# EAGLE design reflow (EAGLE 7.6.0)
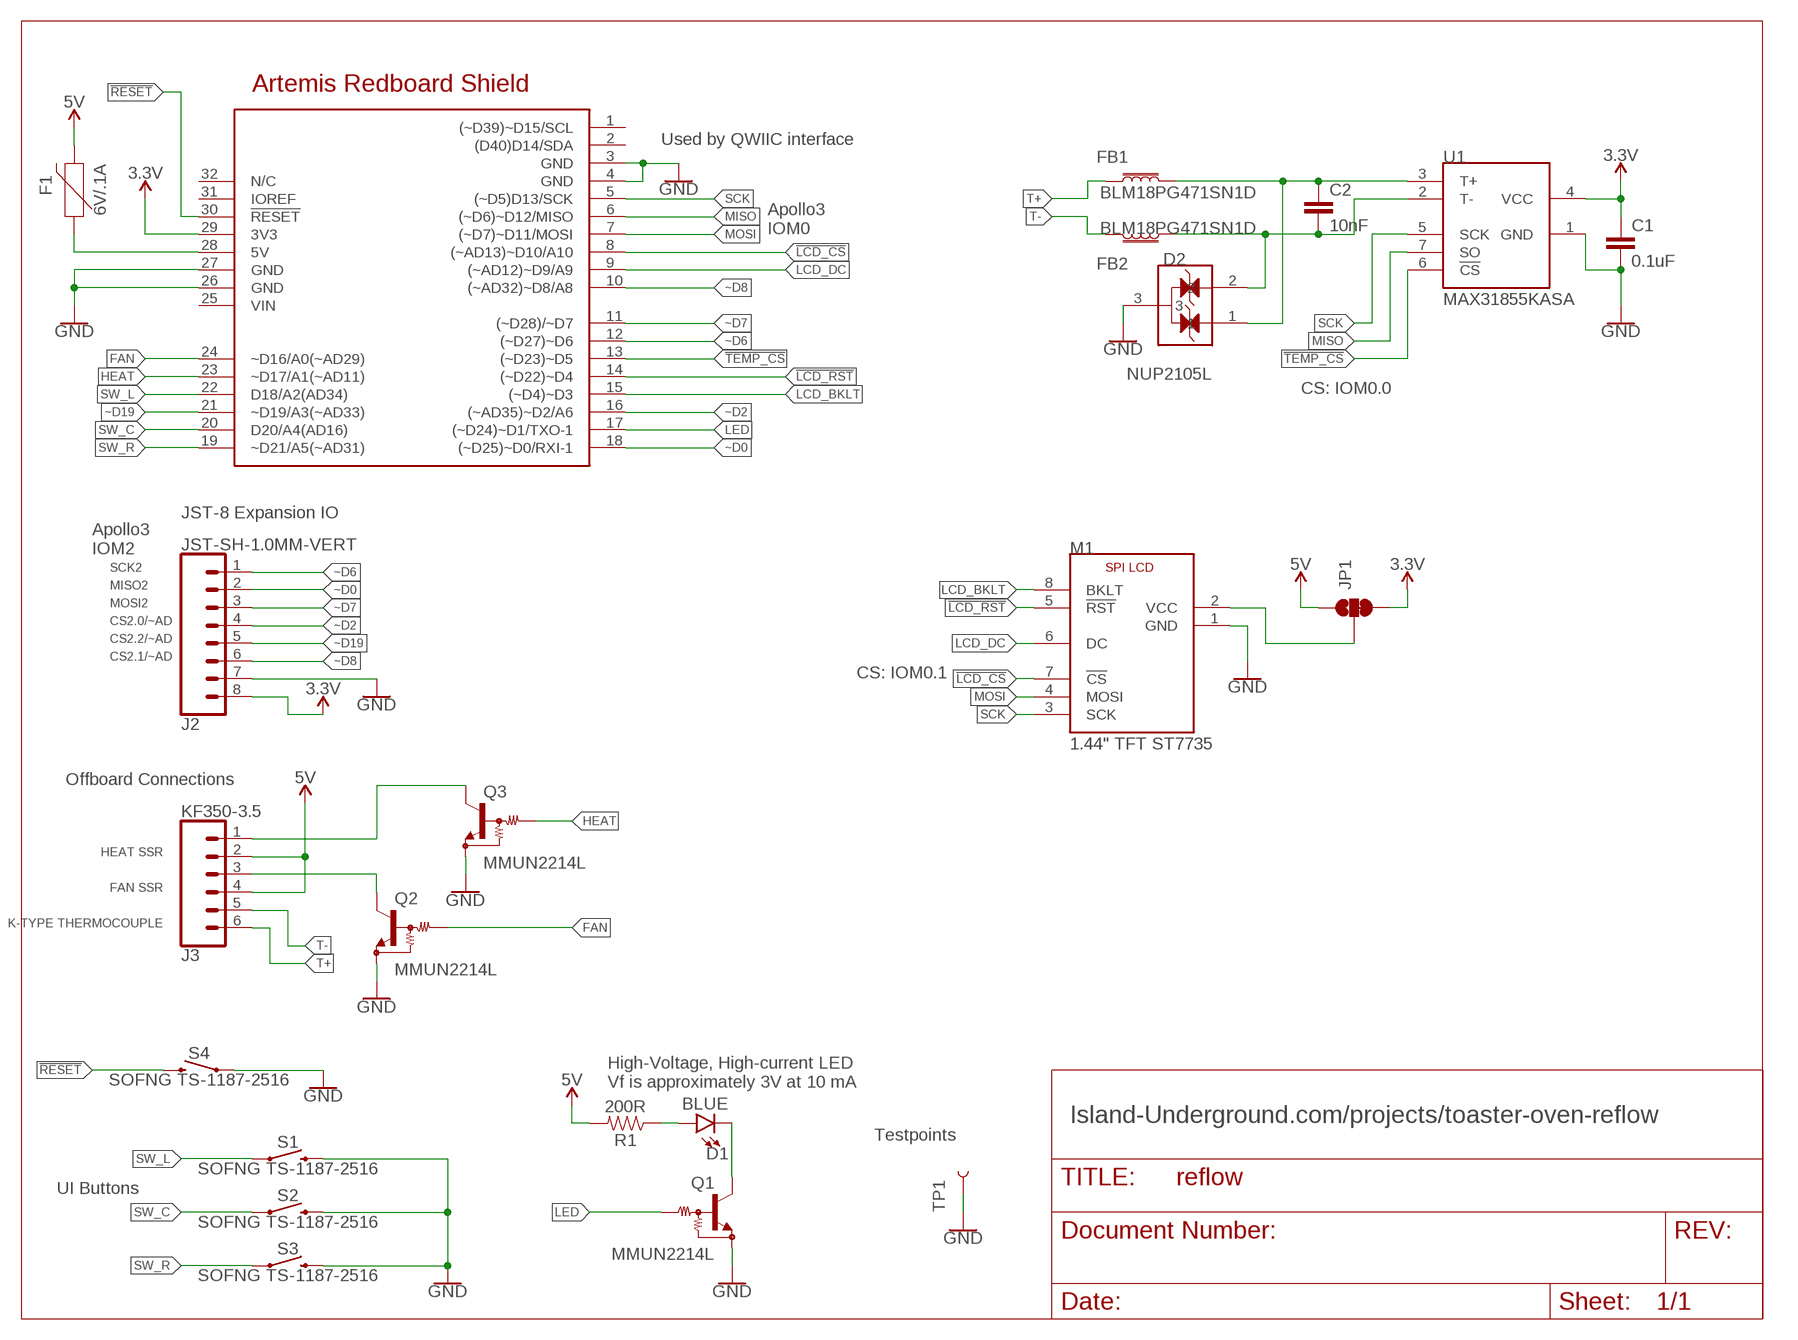
[diagram p0: schematic, sheet 1]

## Parts
C1  0.1uF  CAP-0603  [0603]
C2  10nF  CAP-0603  [0603]
D1  BLUE  LED-BLUE0603  [LED-0603]
D2  NUP2105L  NUP2105L-SOT23  [SOT23]
F1  6V/.1A  PPTC_0.75A  [1206]
FB1  BLM18PG471SN1D  FERRITE_BEAD-0603  [0603]
FB2  BLM18PG471SN1D  FERRITE_BEAD-0603  [0603]
J2  JST-SH-1.0MM-VERT  CON-1X8-JST-SH-1.0MM-VERT  [JST-SH-1.0MM-8V]
J3  KF350-3.5  CONN_063.5MM-6  [SCREWTERMINAL-3.5MM-6]
JP1  JUMPER-SMT_3_1-NC_TRACE_SILK  [SMT-JUMPER_3_1-NC_TRACE_SILK]
M1  1.44" TFT ST7735  SPI-LCD-1P44  [LCD-SPI-1P44]
Q1  MMUN2214L  TRANSISTOR-NPN-PREBIASED-2R-SOT23  [SOT23]
Q2  MMUN2214L  TRANSISTOR-NPN-PREBIASED-2R-SOT23  [SOT23]
Q3  MMUN2214L  TRANSISTOR-NPN-PREBIASED-2R-SOT23  [SOT23]
R1  200R  RESISTOR0603  [0603]
S1  SOFNG TS-1187-2516  SWITCH-TAC-5.2  [SWITCH-TAC-5.2]
S2  SOFNG TS-1187-2516  SWITCH-TAC-5.2  [SWITCH-TAC-5.2]
S3  SOFNG TS-1187-2516  SWITCH-TAC-5.2  [SWITCH-TAC-5.2]
S4  SOFNG TS-1187-2516  SWITCH-TAC-5.2  [SWITCH-TAC-5.2]
TP1  TESTPOINT-KEYSTONE-1035  [KEYSTONE-1035]
U1  MAX31855KASA  MAX31855-SO8  [SOIC-8]
U$1  ARTEMIS_REDBOARD_SHIELD  [ARTEMIS_REDBOARD_SHIELD]

## Nets
3.3V: C1.1 J2.8 JP1.3 U1.4(VCC) U$1.29(3V3)
5V: F1.2 J3.2 J3.4 JP1.1 R1.2
!LCD_CS: M1.7(!CS) U$1.8((~AD13)~D10/A10)
!LCD_RST: M1.5(!RST) U$1.14((~D22)~D4)
!RESET: S4.2@1 S4.2@2 U$1.30(!RESET)
!TEMP_CS: U1.6(!CS) U$1.13((~D23)~D5)
FAN: Q2.1(B) U$1.24(~D16/A0(~AD29))
GND: C1.2 D2.3 J2.7 M1.1(GND) Q1.2(E) Q2.2(E) Q3.2(E) S1.2@1 S1.2@2 S2.2@1 S2.2@2 S3.2@1 S3.2@2 S4.1@1 S4.1@2 TP1.P$1 U1.1(GND) U$1.3(GND) U$1.4(GND) U$1.26(GND) U$1.27(GND)
HEAT: Q3.1(B) U$1.23(~D17/A1(~AD11))
LCD_BKLT: M1.8(BKLT) U$1.15((~D4)~D3)
LCD_DC: M1.6(DC) U$1.9((~AD12)~D9/A9)
LED: Q1.1(B) U$1.17((~D24)~D1/TXO-1)
MISO: U1.7(SO) U$1.6((~D6)~D12/MISO)
MOSI: M1.4(MOSI) U$1.7((~D7)~D11/MOSI)
N$1: D1.C Q1.3(C)
N$2: D1.A R1.1
N$4: F1.1 U$1.28(5V)
N$6: J3.3 Q2.3(C)
N$7: JP1.2 M1.2(VCC)
N$8: J3.1 Q3.3(C)
N$9: C2.1 D2.1 FB1.2 U1.3(T+)
N$10: C2.2 D2.2 FB2.1 U1.2(T-)
SCK: M1.3(SCK) U1.5(SCK) U$1.5((~D5)D13/SCK)
SW_C: S2.1@1 S2.1@2 U$1.20(D20/A4(AD16))
SW_L: S1.1@1 S1.1@2 U$1.22(D18/A2(AD34))
SW_R: S3.1@1 S3.1@2 U$1.19(~D21/A5(~AD31))
T+: FB1.1 J3.6
T-: FB2.2 J3.5
~D0: J2.2 U$1.18((~D25)~D0/RXI-1)
~D2: J2.4 U$1.16((~AD35)~D2/A6)
~D6: J2.1 U$1.12((~D27)~D6)
~D7: J2.3 U$1.11((~D28)/~D7)
~D8: J2.6 U$1.10((~AD32)~D8/A8)
~D19: J2.5 U$1.21(~D19/A3(~AD33))
Unconnected: U$1.1((~D39)~D15/SCL) U$1.2((D40)D14/SDA) U$1.25(VIN) U$1.31(IOREF) U$1.32(N/C)

## Notes on the sheet
- Used by QWIIC interface
- Apollo3
  IOM0
- CS: IOM0.0
- JST-8 Expansion IO
- Apollo3
  IOM2
- SCK2
- MISO2
- MOSI2
- CS2.0/~AD
- CS2.2/~AD
- CS2.1/~AD
- CS: IOM0.1
- Offboard Connections
- HEAT SSR
- FAN SSR
- K-TYPE THERMOCOUPLE
- High-Voltage, High-current LED
  Vf is approximately 3V at 10 mA
- Island-Underground.com/projects/toaster-oven-reflow
- Testpoints
- UI Buttons

## Library data of the parts
C1 C2 = SparkFun-Capacitors:CAP
D1 = SparkFun-LED:LED-BLUE: Blue SMD LED Used in manufacturing of various products at SparkFun Packages: 0603 - SMD 0603 package [Product Link] <http://www.digikey.com/product-detail/en/SMLE12BC7TT86/511-1589-2-ND/1641808> 1206 - SMD1206 package [Product Link] <http://www.digikey.com/product-detail/en/lite-on-inc/LTST-C150TBKT/160-1643-1-ND/573584> SparkFun Products: ESP8266 Thing-Dev Board <https://www.sparkfun.com/products/13711> RedBoard <https://www.sparkfun.com/products/12757>; PROD_ID: DIO-08575
D2 = basics:NUP2105L: Bidirectional TVS (Transient Voltage Suppressor)
F1 = SparkFun-Fuses:PPTC: Resettable Fuse PPTC Resettable Fuse. Really a sort of resistor with a polymeric positive temperature coefficient whose resistance increases dramatically with an increase in temperature. When heated by the power passing through the resistance rises causing the current to be limited, protecting the circuit. This is achieved by the transition of the polymer from a crystalline to an amorphous state where the conductive carbon separates breaking the conductive pathways found in the cool crystalline structure. When a PPTC cools back down it resumes conducting letting the circuit turn back on. SparkFun Products: SparkFun RedBoard - Programmed with Arduino <https://www.sparkfun.com/products/12757> Pro Micro - 5V/16MHz <https://www.sparkfun.com/products/12640> Arduino Pro 328 - 5V/16MHz <https://www.sparkfun.com/products/10915> MP3 Trigger <https://www.sparkfun.com/products/13720>; PROD_ID: RES-11150; VALUE: 6V/0.75A
FB1 FB2 = SparkFun-Coils:FERRITE_BEAD: Ferrite Bead (blocks, cores, rings, chokes, etc.) Inductor with layers of ferrite used to suppress high frequencies. Often used to isolate high frequency noise. SparkFun Products: IOIO-OTG - V2.2 <https://www.sparkfun.com/products/13613> SparkFun SAMD21 Mini Breakout <https://www.sparkfun.com/products/13664> SparkFun 6 Degrees of Freedom Breakout - LSM6DS3 <https://www.sparkfun.com/products/13339> SparkFun SAMD21 Dev Breakout <https://www.sparkfun.com/products/13672>; PROD_ID: NDUC-13805; VALUE: 30Ω/1.8A
J2 = basics:CON-1X8: Single Row 8-Pin Connector A generic symbol for a potential set of connector variants.
J3 = SparkFun-Connectors:CONN_06: Multi connection point. Often used as Generic Header-pin footprint for 0.1 inch spaced/style header connections On any of the 0.1 inch spaced packages, you can populate with these: Break Away Headers - Straight <https://www.sparkfun.com/products/116> (PRT-00116) Break Away Male Headers - Right Angle <https://www.sparkfun.com/products/553> (PRT-00553) Female Headers <https://www.sparkfun.com/products/115> (PRT-00115) Break Away Headers - Machine Pin <https://www.sparkfun.com/products/117> (PRT-00117) Break Away Female Headers - Swiss Machine Pin <https://www.sparkfun.com/products/743> (PRT-00743) Arduino Stackable Header - 6 Pin <https://www.sparkfun.com/products/9280> (PRT-09280) For SCREWTERMINALS and SPRING TERMINALS visit here: Screw Terimnals on SparkFun.com <https://www.sparkfun.com/search/results?term=Screw+Terminals> (5mm/3.5mm/2.54mm spacing) This device is also useful as a general connection point to wire up your design to another part of your project. Our various solder wires solder well into these plated through hole pads. Hook-Up Wire - Assortment (Stranded, 22 AWG) <https://www.sparkfun.com/products/11375> (PRT-11375) Hook-Up Wire - Assortment (Solid Core, 22 AWG) <https://www.sparkfun.com/products/11367> (PRT-11367) View the entire wire category on our website here <https://www.sparkfun.com/categories/141>
JP1 = SparkFun-Jumpers:JUMPER-SMT_3_1-NC_TRACE: Normally closed trace jumper (1 of 2 connections) This jumper has a trace between two pads so it's normally closed (NC). The other connection is normally open (NO). Use a razor knife to open the connection. For best results follow the IPC guidelines for cutting traces: Cutout at least 0.063 mm (0.005 in). Remove all loose material to clean up the cut area. Seal the cut with an approved epoxy. Reapply solder to reclose the connection, or to close the NO connection.
M1 = basics:SPI-LCD: Generic SPI LCD Module Define a set of varying sizes of generic Chinese TFT LCD modules.
Q1-Q3 = basics:TRANSISTOR-NPN-PREBIASED-2R: Generic prebiased NPN Transistor with base R and base-emitter R Resistor values will depend on the specific transistor part number defined by the value field in the schematic. For example: MMUN2214L: RB=10K, RBE=47K MMUN2211L: RB=10K, RBE=10K DDTD113ZC-7-F: RB=2K2, RBE=47K ...and many others
R1 = SparkFun-Resistors:RESISTOR: Generic Resistor Package
S1-S4 = basics:SWITCH: Tactile Switch Tactile momentary switch.
TP1 = basics:TESTPOINT: Testpoint
U1 = basics:MAX31855: MAX31855 This device covers the entire class of MAX31855x devices. The letter code at the end defines the type of thermocouple that the part is calibrated for.
U$1 = basics:ARTEMIS_REDBOARD_SHIELD: Artemis Redboard Shield The hole locations are marked on layer 48 (Document). If you don't want a hole in your board, just ignore them. If you want a mounting hole, just overlay a drill of diameter 0.125 inch centered on the location.

## Board
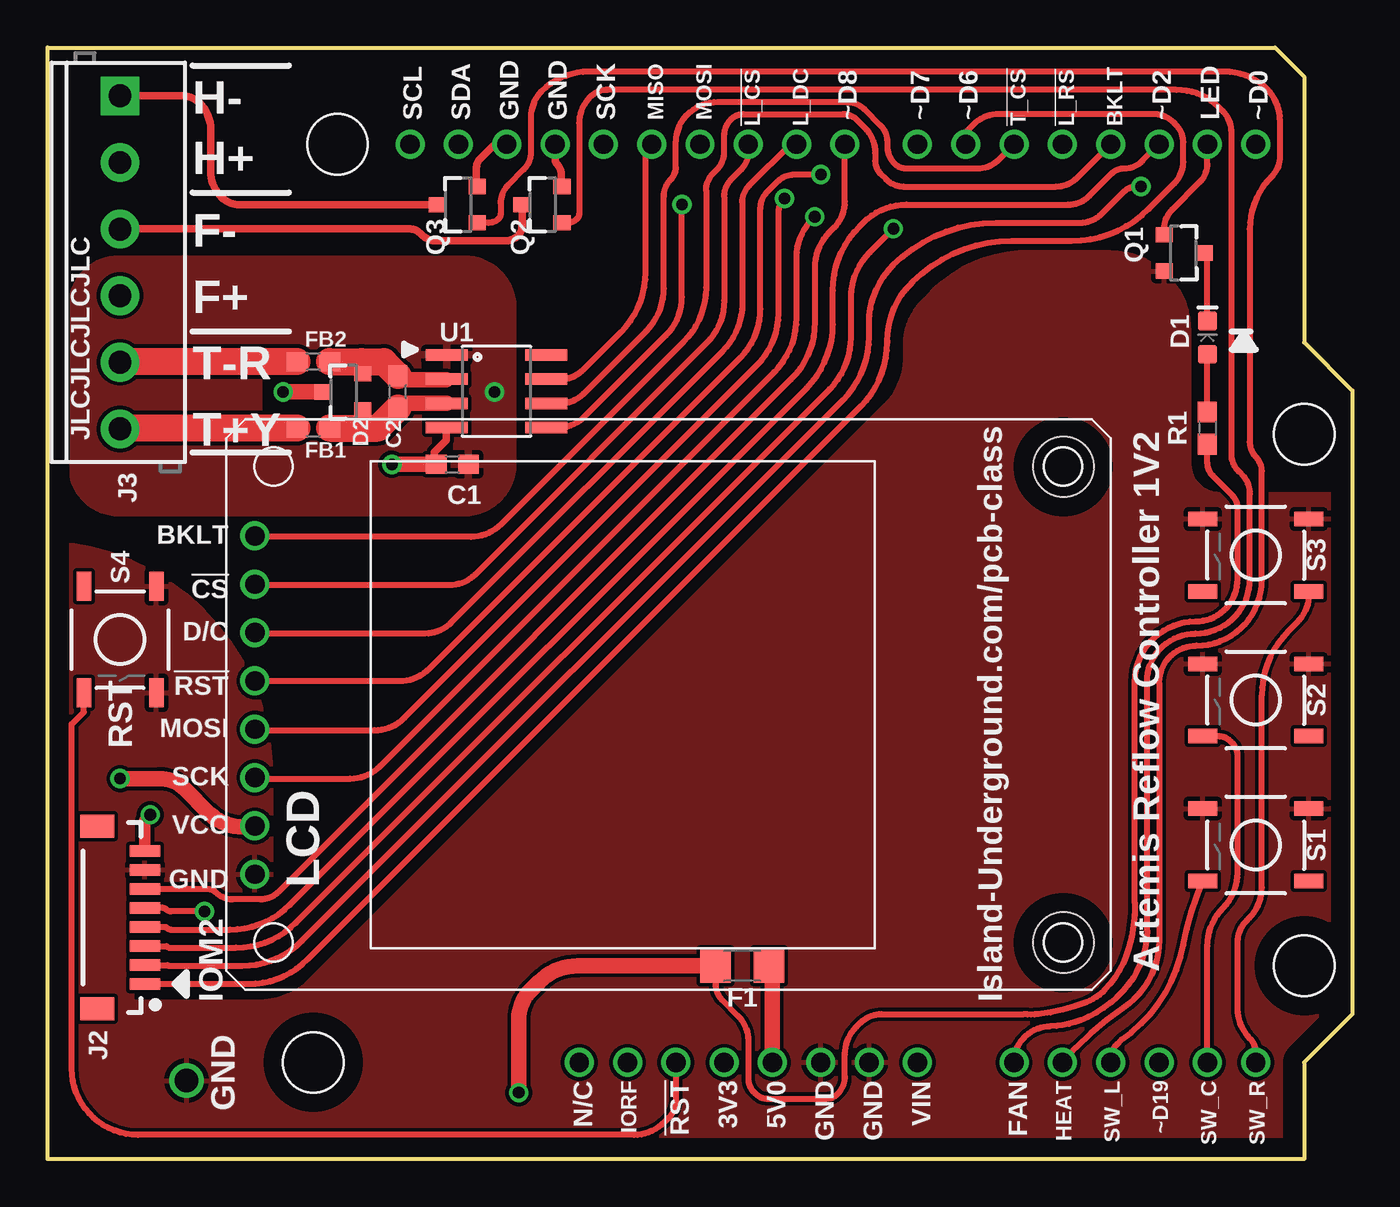
[diagram p1: board, top side]
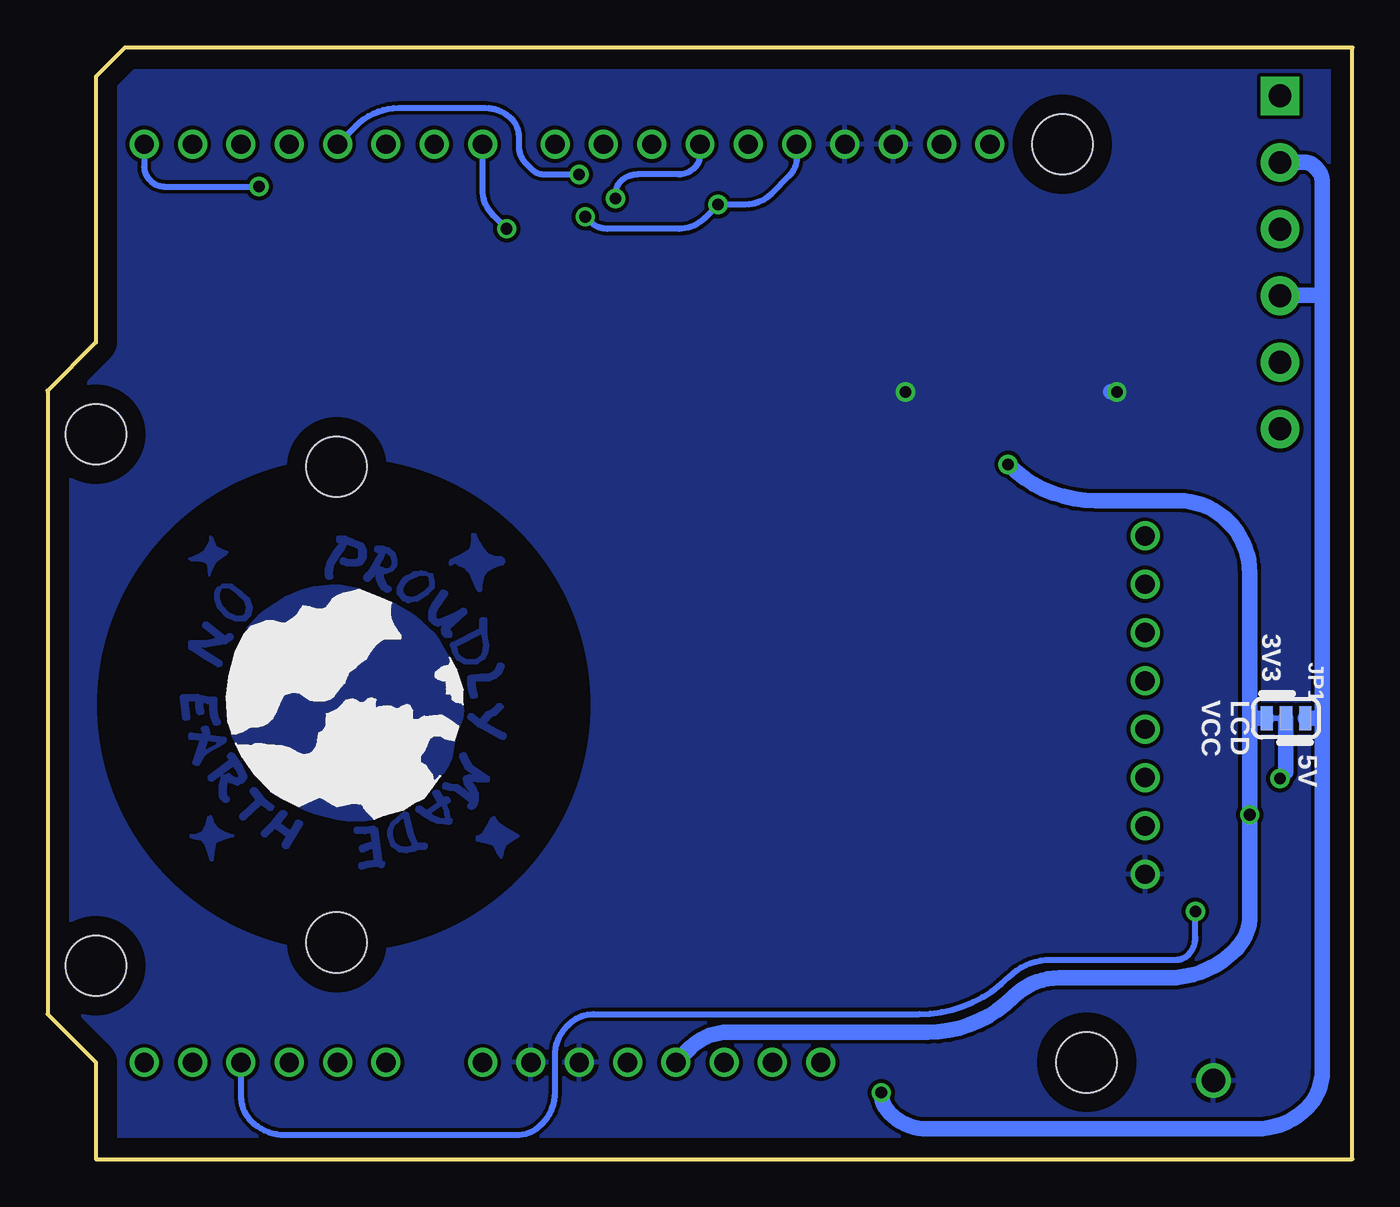
[diagram p2: board, bottom side, seen from below]

Size 68.58 x 58.42 mm. Coordinates in mm from the lower left corner, seen from the top.
Copper layers (1*16): Top 0.035mm / dielectric 1.5mm / Bottom 0.035mm
Design rules "default *": minimum track width 10mil, minimum drill 24mil, track to track 8mil, track to pad 8mil, pad to pad 8mil, via to via 8mil, smd to smd 8mil, copper to edge 40mil, drill to drill 8mil, minimum pad ring 10mil, minimum via ring 8mil, stop-mask expansion 4mil, vias tented up to drill 0mil, thermal gap 10mil
Holes 3.17 mm at 15.24,53.34 13.97,5.08 66.04,10.16 66.04,38.1 53.39,11.38 53.39,36.39
bRestrict: area 50.6,31.1 to 51.1,31.8; area 48.6,29.6 to 49.8,30.6; area 45.7,26.4 to 47,27.5; area 47.7,18 to 48.3,18.5; area 49.5,16.5 to 50.4,17.8; area 59.7,21.6 to 60.2,21.9; area 58.2,28.6 to 59.5,29.9; area 40.2,11.1 to 65.8,36.7

### Footprints (pad centres in the part's own frame; a part is rotated, then mirrored left to right if it is on the bottom)
0603 = smd 1.1 x 1: 1 -0.85,0; 2 0.85,0
LED-0603 = smd 1 x 1: A -0.877,0; C 0.877,0
SOT23 = smd 0.8 x 0.9: 1 -0.95,-1; 2 0.95,-1; 3 0,1.1
1206 = smd 1.6 x 1.8: 1 -1.4,0; 2 1.4,0
JST-SH-1.0MM-8V = smd 0.6 x 1.6: 1 -3.5,-1.3; 2 -2.5,-1.3; 3 -1.5,-1.3; 4 -0.5,-1.3; 5 0.5,-1.3; 6 1.5,-1.3; 7 2.5,-1.3; 8 3.5,-1.3 | smd 1.2 x 1.8: NC1 -4.8,1.2; NC2 4.8,1.2
SCREWTERMINAL-3.5MM-6 = drill 1.2 pad 2.032 square: 1 0,0 | drill 1.2 pad 2.032: 2 3.5,0; 3 7,0; 4 10.5,0; 5 14,0; 6 17.5,0
SMT-JUMPER_3_1-NC_TRACE_SILK = smd 0.635 x 1.27: 1 -1.016,0; 2 0,0; 3 1.016,0
LCD-SPI-1P44 = drill 1.016: 1 6.08,44.98; 2 8.62,44.98; 3 11.16,44.98; 4 13.7,44.98; 5 16.24,44.98; 6 18.78,44.98; 7 21.32,44.98; 8 23.86,44.98
SWITCH-TAC-5.2 = smd 1.524 x 0.762: 1@1 -2.794,1.905; 1@2 2.794,1.905; 2@1 -2.794,-1.905; 2@2 2.794,-1.905
KEYSTONE-1035 = drill 1.219: P$1 0,0
SOIC-8 = smd 0.61 x 2.21: 1 -2.575,-2.516; 2 -1.305,-2.516; 3 -0.035,-2.516; 4 1.235,-2.516; 5 1.235,2.716; 6 -0.035,2.716; 7 -1.305,2.716; 8 -2.575,2.716
ARTEMIS_REDBOARD_SHIELD = drill 1.016: 1 -15.24,24.13; 2 -12.7,24.13; 3 -10.16,24.13; 4 -7.62,24.13; 5 -5.08,24.13; 6 -2.54,24.13; 7 0,24.13; 8 2.54,24.13; 9 5.08,24.13; 10 7.62,24.13; 11 11.43,24.13; 12 13.97,24.13; 13 16.51,24.13; 14 19.05,24.13; 15 21.59,24.13; 16 24.13,24.13; 17 26.67,24.13; 18 29.21,24.13; 19 29.21,-24.13; 20 26.67,-24.13; 21 24.13,-24.13; 22 21.59,-24.13; 23 19.05,-24.13; 24 16.51,-24.13; 25 11.43,-24.13; 26 8.89,-24.13; 27 6.35,-24.13; 28 3.81,-24.13; 29 1.27,-24.13; 30 -1.27,-24.13; 31 -3.81,-24.13; 32 -6.35,-24.13

### Placement (x,y rotation side)
C1  21.27,36.51 0 top
C2  18.41,40.32 90 top
D1  60.96,43.18 90 top
D2  15.56,40.32 90 top
F1  36.51,10.16 180 top
FB1  13.97,38.42 0 top
FB2  13.97,41.91 180 top
J2  3.81,12.7 90 top
J3  3.81,55.88 270 top
JP1  3.49,23.18 180 bottom
M1  55.88,8.89 90 top
Q1  59.69,47.62 270 top
Q2  26.04,50.16 90 top
Q3  21.59,50.16 90 top
R1  60.96,38.42 270 top
S1  63.5,16.51 180 top
S2  63.5,24.13 180 top
S3  63.5,31.75 180 top
S4  3.81,27.3 270 top
TP1  7.3,4.13 0 top
U1  23.5,39.69 270 top
U$1  34.29,29.21 0 top

### Tracks (layer width: path | path; a pad name or v marks a point on that pad's centre or on a via)
3.3V  (via drill 0.61)
  Top 0.406: U1.4 20.94,38.42 20.94,37.77 20.32,37.15 20.32,36.62 C1.1
  Top 0.61: J2.8 5.11,17.81 v5.4,18.1
  Top 0.813: v18.1,36.51 C1.1
  Bottom 0.813: 5.4,23.18 v5.4,18.1 5.4,12.8 arc45 6.14,11 arc45 9.71,9.53 15.42,9.53 arc-45 17.82,8.53 arc45 22.32,6.67 32.84,6.67 arc-45 34.77,5.87 U$1.29 | 5.4,23.18 5.4,30.8 arc-45 6.52,33.51 arc-45 9.18,34.61 13.5,34.61 arc45 v18.1,36.51 | JP1.3 5.4,23.18
5V  (via drill 0.61)
  Top 0.305: F1.2 35.11,9.18 arc45 35.45,8.37 36.27,7.54 arc-45 36.83,6.2 36.83,4.21 arc45 37.11,3.53 37.19,3.45 arc45 37.86,3.17 40.9,3.17 arc45 41.54,3.44 arc45 41.91,4.34 41.91,5.51 arc-45 42.51,6.95 42.72,7.16 arc-45 43.84,7.62 51.31,7.62 arc13 52.07,7.62 arc15 54.61,8.26 arc24 55.56,8.89 arc29 56.83,11.11 arc15 57.15,13.46 57.15,25.08 arc-90 60.33,28.26 arc90 62.55,30.48 62.55,34.21 arc45 62.27,34.89 61.24,35.92 arc-45 60.96,36.59 R1.2
  Top 0.813: F1.2 27.85,10.16 arc45 25.83,9.32 25.42,8.91 arc45 24.77,7.33 v24.77,3.49
  Bottom 0.813: 1.59,45.4 1.59,51.38 arc-45 1.85,52.02 2.04,52.2 arc-45 2.49,52.39 J3.2 | 1.59,45.4 1.59,23.18 | 1.59,23.18 1.59,4.6 arc45 2.37,2.71 arc45 5.08,1.59 22.33,1.59 arc45 24.32,2.41 arc45 v24.77,3.49 | 1.59,45.4 3.79,45.4 J3.4 | JP1.1 1.59,23.18
!LCD_CS
  Top 0.305: U$1.8 36.83,52.91 arc-45 36.46,52.02 35.93,51.49 arc45 35.56,50.59 35.56,45.12 arc-45 34.64,42.89 22.46,30.72 arc-45 21.12,30.16 10.95,30.16 M1.7
!LCD_RST  (via drill 0.61)
  Top 0.305: M1.5 18.48,25.13 arc45 20.08,25.8 36.41,42.13 arc45 37.47,44.67 37.47,49.96 arc-45 37.84,50.85 38.36,51.38 arc-45 39.26,51.75 v40.64,51.75
  Bottom 0.305: U$1.14 52.37,54.31 arc45 50.12,55.24 45.56,55.24 arc45 44.21,54.69 arc45 43.81,53.73 43.81,53.23 arc-45 43.44,52.33 43.14,52.03 arc-45 42.47,51.75 v40.64,51.75
!RESET
  Top 0.305: U$1.30 33.02,3.1 arc-45 32.62,2.15 32.41,1.93 arc-45 30.82,1.27 4.76,1.27 arc-90 1.27,4.76 1.27,22.86 1.91,23.5 S4.2@2
!TEMP_CS
  Top 0.305: U$1.13 49.99,52.53 arc-45 48.87,52.07 45.14,52.07 arc-45 44.5,52.33 arc-45 44.13,53.23 44.13,53.45 arc45 43.76,54.35 42.94,55.17 arc45 41.99,55.56 35.21,55.56 arc45 33.64,54.91 33.58,54.85 arc45 33.02,53.5 33.02,52.12 arc-45 32.76,51.49 arc45 32.38,50.59 32.38,45.77 arc-45 31.45,43.52 28.17,40.23 arc-45 26.93,39.72 U1.6
FAN
  Top 0.305: Q2.1 27.3,49.21 arc45 27.85,49.44 arc45 27.94,49.66 27.94,54.45 arc-45 28.51,55.81 arc-45 29.44,56.2 59.33,56.2 arc-45 61.57,55.27 61.77,55.08 arc-45 62.23,53.95 62.23,37.04 arc45 62.6,36.14 62.9,35.84 arc-45 63.18,34.85 63.18,30.46 arc-90 60.34,27.62 arc90 57.78,25.07 57.78,12.02 arc-37 56.83,9.21 arc-31 54.29,7.3 arc-20 52.7,6.99 arc90 U$1.24
GND  (via drill 0.61)
  Top 0.406: U$1.4 26.67,52.57 arc45 26.8,52.26 arc-45 26.99,51.81 26.99,51.16 Q2.2 | U$1.3 23.76,53.34 arc45 23.31,53.15 22.73,52.57 arc45 22.54,52.12 22.54,51.16 Q3.2
  Top 0.813: 10.85,14.92 M1.1 | D2.3 v12.38,40.32
  Bottom 0.813: v12.38,40.32 12.7,40.32
  other vias: 23.5,40.32
  pour Bottom (rank 2): 0,0 0,58.42 68.58,58.42 68.58,0
  pour Top: 0,0 68.58,0 68.58,34.92 61.59,34.92 arc-90 60.01,36.51 60.01,43.49 arc90 55.87,47.62 51.05,47.62 arc45 46.16,45.21 arc45 45.09,43.06 45.09,42.13 arc-45 44.03,39.59 13.82,9.37 arc-45 11.12,8.26 4.45,8.26 4.45,13.65 11.75,13.65 11.75,19.68 arc90 0,32.38
  pour Top: 21.91,33.97 3.75,33.97 arc-90 1.27,36.45 1.27,44.83 arc-90 3.75,47.31 21.91,47.31 arc-90 24.45,44.77 24.45,36.51 arc-90
HEAT
  Top 0.305: Q3.1 23.18,49.21 arc45 23.72,49.44 arc45 23.81,49.66 23.81,50.24 arc-45 24.21,51.2 25.03,52.02 arc45 25.4,52.91 25.4,54.77 arc-45 25.96,56.12 arc-45 28.44,57.15 61.87,57.15 arc-45 64.11,56.22 arc-45 64.77,54.63 64.77,52.73 arc-45 64.31,51.6 arc45 63.18,48.9 63.18,37.7 arc45 63.52,36.89 arc-45 63.82,36.16 63.82,30.42 arc-90 60.38,26.99 arc90 58.42,25.02 58.42,11.51 arc-56 56.52,7.94 arc16 U$1.23
LCD_BKLT
  Top 0.305: U$1.15 54.12,51.58 arc-45 53,51.12 44.98,51.12 arc-45 44.08,51.49 43.78,51.79 arc-45 43.5,52.47 43.5,52.87 arc45 42.94,54.22 42.52,54.63 arc45 41.81,54.93 36.57,54.93 arc45 35.93,54.66 arc45 35.56,53.77 35.56,52.91 arc-45 35.19,52.02 34.98,51.81 arc45 34.61,50.91 34.61,45.81 arc-45 33.42,42.95 23.83,33.35 arc-45 22.26,32.7 10.95,32.7 M1.8
LCD_DC
  Top 0.305: U$1.9 39.05,53.34 36.88,51.17 arc45 36.51,50.27 36.51,44.98 arc-45 35.46,42.45 21.2,28.18 arc-45 19.85,27.62 10.95,27.62 M1.6
LED
  Top 0.305: U$1.17 60.96,52.31 arc-45 60.56,51.36 59.1,49.9 arc45 58.69,48.9 Q1.1
MISO
  Top 0.305: U1.7 26.93,40.99 arc45 28.17,41.5 30.13,43.47 arc45 31.43,46.61 31.43,52.57 arc-45 U$1.6
MOSI  (via drill 0.61)
  Top 0.305: v38.73,50.48 arc45 38.42,49.72 38.42,44.45 arc-45 37.3,41.74 18.75,23.19 arc-45 17.18,22.54 10.95,22.54 M1.4
  Bottom 0.305: U$1.7 34.29,52.78 arc45 34.57,52.11 arc45 35.43,51.75 37.57,51.75 arc-45 38.47,51.38 arc-45 38.73,50.75 v38.73,50.48
N$1
  Top 0.305: D1.C 60.96,47.45 Q1.3
N$2
  Top 0.305: R1.1 D1.A
N$3
  pour Bottom: 56.8,17.26 57.11,16.94 57.21,16.94 57.28,17.01 57.31,17.04 57.32,17.08 57.32,17.16 57.31,17.2 57.27,17.23 56.74,17.76 56.32,18.25 56.26,18.31 56.16,18.32 56.09,18.26 56.03,18.2 56.02,18.1 56.08,18.04 56.41,17.65 56.41,17.64 56.15,17.47 56.15,17.47 56.15,17.47 56.14,17.47 55.94,17.31 55.78,17.29 55.53,17.71 55.48,17.79 55.38,17.81 55.31,17.77 55.23,17.72 55.21,17.62 55.25,17.55 55.93,16.42 55.98,16.34 56.08,16.32 56.15,16.37 56.2,16.4 56.23,16.45 56.23,16.53 56.22,16.56 56.21,16.59 55.96,16.99 56.03,17 56.05,17.01 56.08,17.02 56.1,17.03 56.33,17.21 56.6,17.38 56.61,17.39 56.62,17.4 56.63,17.41
N$4
  Top 0.813: U$1.28 38.1,9.84 37.91,10.03 F1.1
N$5
  cutout Top: 11.43,40.96 15.24,40.96 15.24,39.37 11.43,39.37
N$6
  Top 0.305: 3.83,48.9 J3.3
  Top 0.406: 3.83,48.9 6.03,48.9 18.97,48.9 arc-45 19.65,48.62 19.72,48.54 arc45 20.4,48.26 24.05,48.26 arc45 24.73,48.54 arc45 24.93,49.04 Q2.3
N$7  (via drill 0.61)
  Top 0.813: v3.81,20 5.88,20 arc-45 7.22,19.45 8.46,18.21 arc45 10.27,17.46 10.85,17.46 M1.2
  Bottom 0.813: JP1.2 3.49,20.32 v3.81,20
N$8
  Top 0.406: Q3.3 10.08,50.16 arc-45 9.13,50.56 arc-45 8.57,51.91 8.57,54.14 arc45 8.02,55.48 arc45 7.06,55.88 J3.1
N$9
  Top 0.254: D2.1 16.56,38.47 16.51,38.42
  Top 0.813: U1.3 18.66,39.72 C2.1
  Top 1.422: FB1.2 16.51,38.42 17.36,38.42 C2.1
N$10
  Top 0.254: D2.2 16.56,41.86 16.51,41.91
  Top 0.61: 20.94,40.96 U1.2
  Top 0.813: 20.94,40.96 18.63,40.96 C2.2
  Top 1.422: FB2.1 16.51,41.91 17.68,41.91 C2.2
N$11
  pour Bottom: 47.53,18.33 47.46,17.97 47.46,17.95 47.46,17.93 47.46,17.91 47.4,17.88 47.35,17.82 47.36,17.74 47.37,17.65 47.45,17.59 47.53,17.6 48.03,17.65 48.04,17.65 48.05,17.65 48.07,17.66 48.42,17.79 48.43,17.79 48.44,17.79 48.45,17.8 48.83,18.05 49.13,18.25 49.17,18.28 49.2,18.33 49.2,18.41 49.19,18.44 49.17,18.47 49.12,18.54 49.02,18.56 48.95,18.51 48.66,18.32 48.65,18.31 48.06,18.74 48.28,19.14 48.29,19.16 48.3,19.19 48.3,19.27 48.27,19.33 48.22,19.36 48.14,19.4 48.04,19.37 48,19.29 47.8,18.93 47.71,18.99 47.64,19.04 47.54,19.02 47.49,18.95 47.44,18.88 47.45,18.78 47.53,18.73 47.66,18.63 47.54,18.37 47.54,18.36 47.53,18.34
N$12
  pour Bottom: 46.58,21.24 46.48,20.98 46.31,20.69 45.88,20.41 45.57,20.19 45.45,20.12 45.39,20.08 45.37,20.01 45.39,19.94 45.41,19.87 45.47,19.82 45.97,19.82 45.98,19.82 45.98,19.82 46.36,19.87 46.35,19.84 46.12,19.54 46.11,19.53 46.11,19.52 46.1,19.51 45.99,19.26 45.98,19.24 45.98,19.22 45.98,18.89 45.98,18.88 45.98,18.87 46.02,18.66 46.03,18.62 46.04,18.6 46.07,18.57 46.18,18.45 46.25,18.39 46.35,18.39 46.41,18.45 46.47,18.52 46.47,18.62 46.41,18.68 46.35,18.74 46.87,19.16 47.15,19.35 47.45,19.39 47.46,19.39 47.47,19.39 47.48,19.4 47.67,19.45 47.74,19.48 47.78,19.54 47.78,19.62 47.78,19.64 47.77,19.66 47.75,19.74 47.66,19.79 47.57,19.76 47.4,19.71 47.07,19.66 47.05,19.66 47.02,19.65 47,19.64 46.69,19.42 46.68,19.42 46.68,19.42 46.67,19.42 46.3,19.11 46.3,19.16 46.39,19.36 46.63,19.67 46.65,19.69 46.66,19.72 46.66,19.74 46.7,19.96 46.71,20.03 46.67,20.11 46.59,20.13 46.46,20.18 46.44,20.19 46.41,20.2 46.39,20.19 46.08,20.16 46.52,20.45 46.54,20.46 46.55,20.48 46.57,20.5 46.76,20.82 46.76,20.83 46.77,20.84 46.77,20.84 46.88,21.12 46.89,21.14 46.89,21.16 46.89,21.24 46.86,21.3 46.79,21.33 46.71,21.36 46.62,21.32
N$13
  pour Bottom: 45.52,28.38 45.52,27.58 45.43,27.06 45.43,27.05 45.43,27.03 45.43,27.02 45.47,26.64 45.48,26.63 45.48,26.62 45.48,26.6 45.59,26.36 45.61,26.33 45.63,26.31 45.65,26.29 45.96,26.08 45.99,26.06 46.02,26.05 46.66,26.05 46.69,26.05 46.71,26.07 47.01,26.24 47.03,26.25 47.05,26.27 47.06,26.29 47.17,26.48 47.18,26.54 47.25,26.58 47.32,26.83 47.37,26.94 47.38,26.96 47.38,26.98 47.38,27.06 47.35,27.12 47.29,27.15 45.84,27.87 45.84,28.38 45.76,28.45 45.59,28.45
N$14
  pour Bottom: 47.62,29.63 48.09,28.96 48.21,28.7 48.21,28.47 48.15,28.38 48.06,28.35 47.81,28.41 47.2,28.69 46.81,28.91 46.74,28.95 46.65,28.93 46.6,28.86 46.56,28.79 46.56,28.7 46.63,28.65 47.47,27.88 47.53,27.78 47.52,27.75 47.43,27.75 47.36,27.68 47.36,27.5 47.43,27.43 47.65,27.43 47.7,27.45 47.73,27.49 47.82,27.58 47.84,27.6 47.85,27.63 47.85,27.67 47.86,27.82 47.86,27.85 47.85,27.89 47.83,27.92 47.72,28.08 47.71,28.09 47.7,28.1 47.68,28.12 47.69,28.12 47.7,28.11 47.71,28.11 47.72,28.11 48.02,28.03 48.05,28.02 48.08,28.02 48.11,28.03 48.25,28.09 48.33,28.15 48.36,28.18 48.44,28.26 48.5,28.34 48.52,28.36 48.53,28.39 48.53,28.75 48.53,28.78 48.52,28.8 48.38,29.1 48.38,29.11 48.37,29.12 48.37,29.13 47.89,29.81 47.84,29.89 47.74,29.9 47.66,29.85 47.59,29.8 47.57,29.7
N$15
  pour Bottom: 49.67,29.27 49.86,29.36 49.89,29.37 49.92,29.39 49.94,29.41 50.14,29.65 50.16,29.68 50.18,29.72 50.18,30.04 50.17,30.07 50.16,30.09 49.99,30.37 49.99,30.38 49.98,30.39 49.97,30.4 49.79,30.6 49.78,30.61 49.76,30.63 49.74,30.63 49.45,30.76 49.45,30.76 49.44,30.77 49.44,30.77 49.33,30.86 49.32,30.87 49.3,30.87 49.29,30.87 48.97,30.9 48.95,30.91 48.93,30.9 48.75,30.87 48.73,30.86 48.72,30.86 48.7,30.85 48.58,30.78 48.39,30.76 48.36,30.72 48.35,30.67 48.29,30.37 48.29,30.36 48.29,30.34 48.29,30.04 48.3,30 48.33,29.97 48.59,29.7 48.6,29.69 48.61,29.69 48.62,29.68 49.13,29.35 49.14,29.35 49.16,29.34 49.17,29.34 49.58,29.27 49.61,29.26 49.64,29.26
N$16
  pour Bottom: 46.14,32.88 46.08,32.79 45.99,32.59 45.88,32.4 45.73,32.14 45.62,32 45.5,31.84 45.26,31.72 45.04,31.65 44.73,31.65 44.61,31.55 44.57,31.41 44.7,31.23 44.89,31.18 45.16,31.08 45.51,30.91 45.64,30.74 45.71,30.52 45.78,30.16 45.78,29.88 45.85,29.81 45.97,29.88 46.09,30.12 46.26,30.53 46.37,30.78 46.55,30.96 46.61,31.06 46.83,31.16 46.96,31.2 47.1,31.31 47.27,31.28 47.42,31.2 47.47,31.32 47.39,31.49 47.13,31.62 46.84,31.77 46.64,31.89 46.37,32.04 46.32,32.22 46.25,32.53 46.25,32.88
N$17
  pour Bottom: 60.15,31.24 60.27,31.37 60.59,31.43 61,31.45 61.17,31.55 60.61,31.78 60.28,31.99 60.03,32.45 60.03,32.75 59.92,32.65 59.76,32.2 59.35,31.99 59.1,31.92 59.26,31.75 59.76,31.37 59.99,30.93 60.1,30.65
N$18
  pour Bottom: 53.93,30.57 53.97,30.72 53.97,30.73 53.97,30.74 53.97,30.76 53.97,30.76 53.97,30.76 53.95,31.05 53.95,31.07 53.95,31.08 53.94,31.09 53.85,31.39 53.85,31.4 53.84,31.41 53.84,31.43 53.71,31.63 53.51,31.94 53.51,31.94 53.5,31.95 53.5,31.95 53.3,32.2 53.23,32.37 53.23,32.42 53.31,32.43 53.37,32.5 53.37,32.67 53.29,32.74 52.94,32.74 52.92,32.73 52.9,32.72 52.59,32.58 52.08,32.38 52.05,32.36 52.02,32.34 52,32.31 51.89,32.11 51.88,32.09 51.87,32.06 51.87,31.6 51.88,31.57 51.89,31.54 52.05,31.31 52.07,31.28 52.09,31.25 52.12,31.24 52.24,31.2 52.25,31.19 52.27,31.19 52.86,31.19 52.88,31.19 52.9,31.2 53.07,31.27 53.15,31.3 53.19,31.39 53.16,31.48 53.13,31.56 53.03,31.6 52.95,31.57 52.81,31.51 52.32,31.51 52.29,31.52 52.19,31.68 52.19,31.99 52.25,32.1 52.71,32.28 52.71,32.28 52.72,32.29 52.72,32.29 52.91,32.37 52.91,32.32 52.91,32.3 52.92,32.28 53.01,32.05 53.02,32.04 53.03,32.03 53.04,32.02 53.25,31.76 53.55,31.27 53.63,31.01 53.65,30.76 53.61,30.63 53.59,30.6 53.65,30.51 53.74,30.49 53.82,30.47 53.91,30.53
N$19
  pour Bottom: 51.27,30.49 51.27,30.51 51.28,30.53 51.28,30.54 51.28,30.78 51.3,30.86 51.52,30.6 51.66,30.44 51.72,30.38 51.82,30.37 51.88,30.43 51.92,30.46 51.94,30.5 51.94,30.58 51.93,30.62 51.9,30.65 51.77,30.81 51.56,31.06 51.34,31.46 51.34,31.46 51.34,31.46 51.34,31.47 51.18,31.73 51.13,31.9 51.29,31.9 51.36,31.97 51.36,32.15 51.29,32.22 50.96,32.22 50.94,32.21 50.93,32.21 50.66,32.11 50.64,32.11 50.62,32.1 50.61,32.08 50.39,31.89 50.36,31.87 50.35,31.84 50.34,31.81 50.26,31.49 50.26,31.48 50.26,31.46 50.26,31.22 50.27,31.18 50.29,31.15 50.46,30.95 50.48,30.93 50.5,30.91 50.53,30.9 50.75,30.82 50.79,30.8 50.83,30.8 50.87,30.82 50.97,30.86 50.97,30.84 50.97,30.83 50.96,30.82 50.96,30.81 50.96,30.58 50.87,30.34 50.77,30.18 50.65,30.1 50.57,30.06 50.55,29.96 50.6,29.88 50.64,29.81 50.74,29.78 50.82,29.83 50.97,29.92 50.99,29.94 51.01,29.96 51.02,29.98 51.15,30.19 51.16,30.2 51.16,30.21 51.16,30.22
N$20
  pour Bottom: 58.21,28.3 58.7,28.3 58.72,28.3 58.74,28.31 59.16,28.49 59.18,28.5 59.2,28.51 59.21,28.53 59.56,28.9 59.58,28.92 59.59,28.94 59.6,28.96 59.75,29.36 59.76,29.37 59.76,29.39 59.76,29.8 59.75,29.83 59.74,29.86 59.66,29.98 59.61,30.05 59.53,30.07 59.45,30.04 59.45,30.04 59.45,30.04 59.45,30.13 59.38,30.21 58.93,30.21 58.89,30.19 58.86,30.17 58.44,29.85 58.43,29.85 58.43,29.84 58.43,29.84 58.02,29.48 58,29.46 57.98,29.44 57.97,29.41 57.86,29.03 57.85,29.01 57.85,28.98 57.86,28.96 57.92,28.61 57.92,28.58 57.94,28.55 57.96,28.52 58.14,28.35 58.17,28.32
N$21
  pour Bottom: 59.69,25.92 60.39,26.36 61.07,26.79 61.11,26.82 61.14,26.87 61.14,27.17 61.07,27.24 60.31,27.24 60.12,27.28 60.12,27.28 60.11,27.28 60.11,27.28 59.98,27.3 59.82,27.33 59.79,27.34 59.74,27.37 59.69,27.37 59.65,27.37 60.34,27.92 60.38,27.96 60.4,28 60.4,28.08 60.39,28.12 60.37,28.15 60.31,28.22 60.21,28.23 60.14,28.17 59.28,27.48 59.27,27.48 59.26,27.47 59.26,27.46 59.13,27.56 59.05,27.62 58.95,27.6 58.9,27.53 58.85,27.46 58.86,27.36 58.93,27.31 59.17,27.13 59.19,27.11 59.21,27.1 59.24,27.1 59.57,27.04 59.6,27.03 59.63,27.04 59.66,27.05 59.66,27.05 59.66,27.05 59.66,27.05 59.69,27.03 59.78,27.01 60.06,26.96 60.26,26.92 60.27,26.92 60.28,26.92 60.67,26.92 60.21,26.63 59.51,26.19 59.44,26.14 59.42,26.04 59.47,25.97 59.51,25.89 59.61,25.87
N$22
  pour Bottom: 46.41,24.62 46.46,24.96 46.46,24.97 46.46,24.97 46.46,25.34 46.4,25.41 46.32,25.42 45.86,25.47 45.85,25.47 45.84,25.47 45.42,25.47 45.18,25.58 45.05,25.69 44.93,25.96 44.89,26.04 44.8,26.07 44.72,26.04 44.63,26 44.6,25.91 44.63,25.83 44.77,25.52 44.78,25.5 44.8,25.48 44.82,25.46 44.99,25.32 45.01,25.31 45.02,25.3 45.03,25.29 45.32,25.17 45.34,25.16 45.36,25.15 45.83,25.15 46.14,25.12 46.14,24.99 46.1,24.67 46.03,24.43 46.01,24.34 46.06,24.26 46.23,24.21 46.32,24.26 46.34,24.34 46.41,24.6 46.41,24.6 46.41,24.61
N$23
  pour Bottom: 59.84,22.92 59.96,23.17 59.96,23.19 59.97,23.2 59.97,23.22 60.02,23.66 60.02,23.67 60.03,23.68 60.03,23.94 60.15,23.94 60.16,23.94 60.17,23.95 60.42,24.01 60.44,23.94 60.44,23.78 60.39,23.56 60.38,23.48 60.43,23.39 60.52,23.37 60.61,23.36 60.69,23.41 60.71,23.5 60.76,23.73 60.76,23.74 60.76,23.75 60.76,23.97 60.76,23.98 60.75,23.99 60.73,24.09 60.74,24.09 61.23,24.09 61.13,23.26 61.12,23.17 61.18,23.09 61.27,23.08 61.36,23.07 61.44,23.13 61.45,23.22 61.57,24.24 61.57,24.24 61.57,24.25 61.57,24.29 61.55,24.33 61.53,24.36 61.5,24.4 61.45,24.42 60.7,24.42 60.69,24.41 60.68,24.41 60.11,24.26 59.78,24.26 59.7,24.19 59.7,23.69 59.65,23.28 59.55,23.05 59.51,22.97 59.55,22.87 59.63,22.84 59.71,22.8 59.8,22.84
N$24
  pour Bottom: 45.97,22.76 46.4,23.12 46.44,23.15 46.46,23.19 46.46,23.28 46.45,23.31 46.42,23.34 46.37,23.41 46.26,23.42 46.2,23.36 45.84,23.07 45.71,23.23 45.49,23.48 45.48,23.49 45.46,23.5 45.44,23.51 45.22,23.63 44.95,23.88 44.89,23.95 44.79,23.94 44.72,23.88 44.66,23.82 44.66,23.72 44.73,23.65 45.01,23.38 45.02,23.37 45.03,23.36 45.05,23.35 45.27,23.24 45.47,23.01 45.57,22.9 44.6,22.38 44.52,22.34 44.49,22.24 44.54,22.17 44.58,22.09 44.68,22.06 44.75,22.1 45.94,22.74 45.95,22.75 45.96,22.75
N$25
  pour Bottom: 60.81,20.72 60.88,20.76 60.92,20.84 60.9,20.92 60.54,22.01 61,22.07 61.08,22.08 61.14,22.15 61.14,22.23 61.14,22.24 61.14,22.25 61.13,22.33 61.05,22.4 60.96,22.38 60.43,22.32 60.41,22.4 60.45,22.53 60.47,22.62 60.42,22.7 60.34,22.73 60.25,22.75 60.16,22.7 60.14,22.62 60.09,22.44 60.08,22.41 60.08,22.38 60.09,22.35 60.11,22.28 59.36,22.18 59.29,22.17 59.24,22.12 59.22,22.06 59.21,22 59.23,21.93 59.29,21.89 59.55,21.7 59.56,21.7 59.56,21.69 59.57,21.69 60.05,21.45 60.37,21.21 60.6,20.79 60.64,20.72 60.73,20.69
N$26
  pour Bottom: 59.33,18.81 59.43,18.89 59.44,18.91 59.46,18.93 59.47,18.95 59.53,19.09 59.54,19.11 59.54,19.13 59.54,19.63 59.54,19.64 59.53,19.66 59.43,20.06 59.42,20.11 59.38,20.15 59.32,20.17 59.13,20.23 59.08,20.25 59.02,20.24 58.98,20.2 58.84,20.09 58.62,20.01 58.53,20.05 58.48,20.12 58.62,20.45 58.8,20.71 59.86,19.92 59.93,19.87 60.03,19.88 60.09,19.96 60.11,19.98 60.12,20.02 60.12,20.1 60.1,20.15 60.05,20.18 58.98,20.98 59.05,21.09 59.1,21.16 59.08,21.26 59.01,21.31 58.93,21.36 58.83,21.34 58.79,21.27 58.35,20.62 58.34,20.61 58.34,20.6 58.34,20.59 58.15,20.16 58.13,20.1 58.13,20.04 58.17,20 58.3,19.83 58.31,19.81 58.33,19.79 58.36,19.78 58.54,19.69 58.58,19.67 58.62,19.67 58.66,19.69 58.97,19.8 58.99,19.8 59,19.81 59.02,19.82 59.11,19.9 59.14,19.89 59.22,19.6 59.22,19.19 59.18,19.11 59.12,19.04 59.05,18.98 59.05,18.88 59.11,18.82 59.17,18.75 59.27,18.75
N$27
  pour Bottom: 57.59,18.89 57.87,19.24 57.89,19.27 57.9,19.31 57.9,19.39 57.88,19.44 57.84,19.47 57.77,19.52 57.67,19.51 57.61,19.44 57.3,19.03 57.14,18.89 56.8,18.64 56.73,18.58 56.72,18.48 56.77,18.41 56.82,18.34 56.92,18.33 56.99,18.38 57.33,18.64 57.34,18.64 57.34,18.64 57.35,18.64 57.36,18.66 58.19,17.9 58.25,17.84 58.35,17.84 58.41,17.9 58.44,17.93 58.46,17.97 58.46,18.06 58.44,18.1 58.41,18.13
N$28
  pour Bottom: 59.99,15.69 60.13,16.12 60.29,16.56 60.45,16.75 60.78,16.82 61.06,16.9 61.06,17.06 60.82,17.06 60.65,17.11 60.49,17.17 60.39,17.27 60.31,17.41 60.25,17.53 60.13,17.99 60.01,18.05 59.94,17.94 59.88,17.65 59.69,17.42 59.39,17.24 59.01,17.08 58.82,17.04 58.82,16.96 59.41,16.78 59.76,16.61 59.84,16.23 59.9,15.8 59.9,15.69
N$29
  pour Bottom: 52.2,15.38 52.2,15.4 52.21,15.41 52.21,15.49 52.16,15.56 52.08,15.58 51.78,15.65 51.78,15.66 51.77,15.66 51.76,15.66 51.37,15.71 51.46,16.35 51.77,16.25 51.94,16.18 52.02,16.14 52.12,16.18 52.15,16.26 52.16,16.28 52.16,16.3 52.16,16.39 52.13,16.45 52.07,16.47 51.89,16.55 51.88,16.55 51.88,16.55 51.87,16.55 51.5,16.68 51.56,17.16 51.88,17.12 51.89,17.12 51.89,17.12 52.36,17.12 52.44,17.19 52.44,17.37 52.36,17.44 51.91,17.44 51.51,17.49 51.47,17.5 51.43,17.49 51.4,17.47 51.33,17.41 51.29,17.39 51.26,17.35 51.26,17.3 51.05,15.71 51.05,15.7 51.05,15.68 51.05,15.66 51.01,15.65 50.93,15.63 50.88,15.54 50.9,15.46 50.92,15.37 51.01,15.32 51.1,15.34 51.29,15.39 51.71,15.34 52.01,15.27 52.09,15.24 52.18,15.3
N$38
  pour Bottom: 58.89,22.4 58.65,22.4 58.35,22.53 58.08,22.68 57.86,22.77 57.5,22.77 57.26,22.83 57,22.97 56.76,23.19 56.58,23.53 56.42,23.9 56.25,24.3 56.13,24.47 55.86,24.55 55.68,24.59 55.29,24.54 55.01,24.33 54.77,24.18 54.61,24.14 54.17,24.14 53.97,24.15 53.76,24.21 53.55,24.37 53.38,24.59 53.19,24.84 52.98,25.06 52.82,25.45 52.72,25.66 52.38,25.91 52.06,26.19 51.83,26.34 51.69,26.58 51.45,26.92 51.27,27.15 51.06,27.32 50.84,27.4 50.02,27.4 50.02,27.57 50.12,27.67 50.31,27.95 50.44,28.17 50.57,28.54 50.57,29.04 50.5,29.24 50.31,29.17 50.12,29.05 49.48,28.69 49.26,28.53 48.94,28.25 48.29,27.64 48.01,27.22 47.58,26.48 47.39,26.13 47.3,26 47.55,25.96 47.88,25.87 48.03,25.73 48.2,25.56 48.2,25.4 48.05,25.29 47.84,25.2 47.65,25.2 47.61,24.92 47.61,24.72 47.6,24.5 47.41,24.5 47.3,24.37 47.3,24.21 47.1,24.07 46.81,24.01 46.76,23.84 46.76,23.71 46.73,23.57 46.75,23.42 46.78,23.18 46.86,22.97 46.97,22.8 47.22,22.9 47.39,23.03 47.59,23.17 47.86,23.32 48.01,23.32 48.32,23.31 48.75,23.26 48.76,23.29 48.82,23.26 48.89,23.23 49.13,23.1 49.34,23.1 49.41,23.16 49.4,23.6 49.55,23.85 49.69,23.9 49.95,23.8 50.1,23.69 50.25,23.68 50.53,23.79 50.76,23.82 51.16,23.78 51.33,23.7 51.38,23.9 51.32,24.16 51.39,24.18 51.54,24.25 51.75,24.19 51.82,24.1 51.96,23.99 52.2,24 52.34,24.12 52.55,24.19 52.91,24.11 53.11,23.87 53.35,23.63 53.79,23.44 53.92,23.41 53.92,23.14 53.94,22.79 54.08,22.55 54.18,22.47 54.32,22.4 54.39,22.05 54.41,21.84 54.49,21.63 54.73,21.37 54.85,21.3 55.12,21.26 55.4,21.35 55.6,21.46 55.88,21.62 56.27,21.73 56.66,21.76 56.92,21.76 57.3,21.82 57.68,21.83 57.87,21.72 58.13,21.77 58.46,21.77 58.64,21.77 58.7,21.88 58.78,22.08 58.89,22.31
N$39
  pour Bottom: 51.39,17.89 51.72,18.22 51.94,18.47 51.94,18.52 52.06,18.71 52.51,18.76 53,18.66 53.37,18.56 53.57,18.67 53.97,18.95 54.29,19.08 54.65,18.93 54.99,18.77 55.41,18.56 55.03,18.37 54.53,18.17 54.01,18.04 53.4,17.89 52.88,17.8 51.89,17.8
N$40
  pour Bottom: 47.37,21.05 47.51,20.73 47.8,20.29 48.07,20.05 48.2,19.91 48.28,19.87 48.37,20.24 48.56,20.47 48.69,20.7 48.99,20.86 48.99,21.24 48.78,21.49 48.68,21.75 48.49,22.17 48.27,22.31 47.92,22.31 47.68,22.14 47.5,22.1 47.2,22.04
N$41
  pour Bottom: 52.2,29.96 53.15,30.15 53.75,30.15 54.58,30.05 55.19,29.89 56.01,29.54 57.21,28.77 57.5,28.54 58.09,27.92 57.42,28.17 57.09,28.3 56.68,28.3 56.24,28.16 56.02,28.18 55.72,28.39 55.42,28.68 55.27,28.94 55.15,29.1 54.82,29.04 54.49,28.93 54.17,28.91 53.96,28.97 53.8,29.16 53.61,29.42 53.35,29.61 53.07,29.74 52.67,29.81
N$50
  pour Bottom: 49.37,17.04 49.17,16.6 49.15,16.61 49.13,16.61 48.73,16.61 48.66,16.54 48.66,16.36 48.73,16.29 49.08,16.29 49.3,16.19 49.31,16.19 49.33,16.19 49.34,16.18 49.69,16.12 49.7,16.11 49.72,16.11 49.74,16.11 50.05,16.16 50.08,16.16 50.11,16.17 50.13,16.19 50.47,16.43 50.5,16.45 50.52,16.48 50.53,16.51 50.65,16.92 50.66,16.93 50.66,16.95 50.66,17.31 50.66,17.33 50.65,17.35 50.53,17.62 50.52,17.65 50.51,17.67 50.49,17.68 50.16,17.96 50.16,17.96 50.16,17.97 50.16,17.97 49.88,18.19 49.83,18.23 49.78,18.24 49.73,18.22 49.67,18.2 49.63,18.16 49.62,18.11
N$56
  pour Bottom: 43.79,17.01 44.57,17.44 44.88,17.65 45.1,17.99 45.26,17.92 45.53,17.42 45.76,17.06 46.05,16.93 46.05,16.79 45.97,16.73 45.5,16.64 45.16,16.52 44.92,16.05 44.73,15.81 44.67,15.96 44.64,16.07 44.58,16.35 44.48,16.54 44.19,16.77
SCK  (via drill 0.61)
  Top 0.305: 26.25,38.42 U1.5 26.84,38.45 arc45 28.24,39.03 32.5,43.3 arc45 33.34,45.32 v33.34,50.16 | M1.3 10.95,20 15.91,20 arc45 17.48,20.65 38.19,41.36 arc45 39.37,44.22 39.37,47.39 arc-45 40.21,49.42 v40.32,49.53
  Bottom 0.305: U$1.5 29.21,52.63 arc45 29.61,51.67 30.56,50.72 arc45 31.9,50.16 v33.34,50.16 34.05,49.45 arc45 35.4,48.9 39.16,48.9 arc45 40.06,49.27 v40.32,49.53
SW_C
  Top 0.305: U$1.20 60.96,11.2 arc-45 61.8,13.22 61.8,13.22 arc45 62.55,15.03 62.55,21.2 arc45 62.27,21.87 62.19,21.95 arc45 61.52,22.23 S2.1@2
SW_L
  Top 0.305: U$1.22 55.88,5.24 arc-45 56.22,6.05 56.44,6.27 arc45 59.69,11.24 arc-12 S1.1@2
SW_R
  Top 0.305: U$1.19 63.5,5.64 arc45 63.22,6.31 arc-45 62.55,7.94 62.55,11.39 arc-45 63.02,12.54 63.16,12.68 arc45 63.82,14.27 63.82,24.38 arc-45 65.21,27.75 65.66,28.2 arc45 66.29,29.72 S3.1@1
T+
  Top 1.422: FB1.1 3.85,38.42 J3.6
T-
  Top 1.422: FB2.2 3.84,41.91 J3.5
~D0  (via drill 0.61)
  Top 0.305: J2.2 6.31,10.2 6.35,10.16 10.22,10.16 arc45 13.37,11.46 41.8,39.89 arc45 43.18,43.23 43.18,43.95 arc-45 44.43,46.97 arc-45 49.84,49.21 54.27,49.21 arc45 55.39,49.68 56.55,50.84 arc-45 57.23,51.12 v57.47,51.12
  Bottom 0.305: U$1.18 63.5,52.15 arc-45 63.22,51.47 63.14,51.4 arc-45 62.47,51.12 v57.47,51.12
~D2
  Top 0.305: J2.4 6.16,12.2 arc-45 6.26,12.16 arc45 6.48,12.06 9.59,12.06 arc45 12.73,13.37 39.89,40.53 arc45 41.27,43.87 41.27,45.65 arc-45 42.67,49.02 42.88,49.23 arc-45 45.13,50.16 53.63,50.16 arc45 54.76,50.63 55.93,51.81 arc-45 56.57,52.07 56.59,52.07 arc45 57.55,52.47 U$1.16
~D6
  Top 0.305: U$1.12 48.26,53.98 48.66,54.37 arc-45 50,54.93 58.08,54.93 arc-45 59.2,54.46 59.32,54.35 arc-45 59.69,53.45 59.69,52.41 arc-45 59.23,51.29 57.88,49.94 arc-45 53.82,48.26 50.66,48.26 arc45 45.48,46.11 45.38,46.02 arc45 44.13,43 44.13,42.91 arc-45 42.75,39.58 13.68,10.51 arc-45 10.54,9.21 J2.1
~D7  (via drill 0.61)
  Top 0.305: J2.3 6.26,11.2 6.35,11.11 9.91,11.11 arc45 13.05,12.41 41.11,40.47 arc45 42.23,43.18 42.23,45.27 arc-45 43.22,47.66 v44.45,48.9
  Bottom 0.305: v44.45,48.9 45.16,49.61 arc45 45.72,50.95 U$1.11
~D8
  Top 0.305: U$1.10 41.91,50.32 arc-45 41.35,48.97 41.07,48.69 arc45 40.32,46.89 40.32,44 arc-45 39.07,40.98 12.14,14.05 arc-45 11.19,13.65 9.71,13.65 arc-45 8.85,14.01 arc45 8.39,14.2 J2.6
~D19  (via drill 0.61)
  Top 0.305: J2.5 6.04,13.2 arc-45 6.26,13.11 arc45 6.48,13.02 v8.26,13.02
  Bottom 0.305: U$1.21 58.42,3.28 arc-45 57.89,2.01 arc-45 56.1,1.27 43.92,1.27 arc-45 42.65,1.8 42.56,1.89 arc-45 41.91,3.46 41.91,5.43 arc45 41.26,7 41.17,7.09 arc45 39.9,7.62 22.76,7.62 arc-45 18.05,9.57 arc45 15.87,10.48 9.26,10.48 arc-45 8.63,10.74 arc-45 8.26,11.64 v8.26,13.02

### Text on the board
tNames: H- | SCL | SDA | GND | GND | SCK | MISO | MOSI | ~D8 | ~D7 | ~D6 | ~D2 | LED | ~D0 | !L_CS | L_DC | !T_CS | !L_RS | BKLT | H+ | F- | F+ | T-R | JLCJLCJLCJLC | T+Y | BKLT | !CS | D/C | !RST | MOSI | RST | SCK | VCC | GND | LCD | Artemis Reflow Controller 1V2 | IOM2 | Island-Underground.com/pcb-class | N/C | IORF | !RST | 3V3 | 5V0 | GND | GND | VIN | FAN | HEAT | SW_L | ~D19 | SW_C | SW_R | GND
bNames: 3V3 | LCD / VCC | 5V